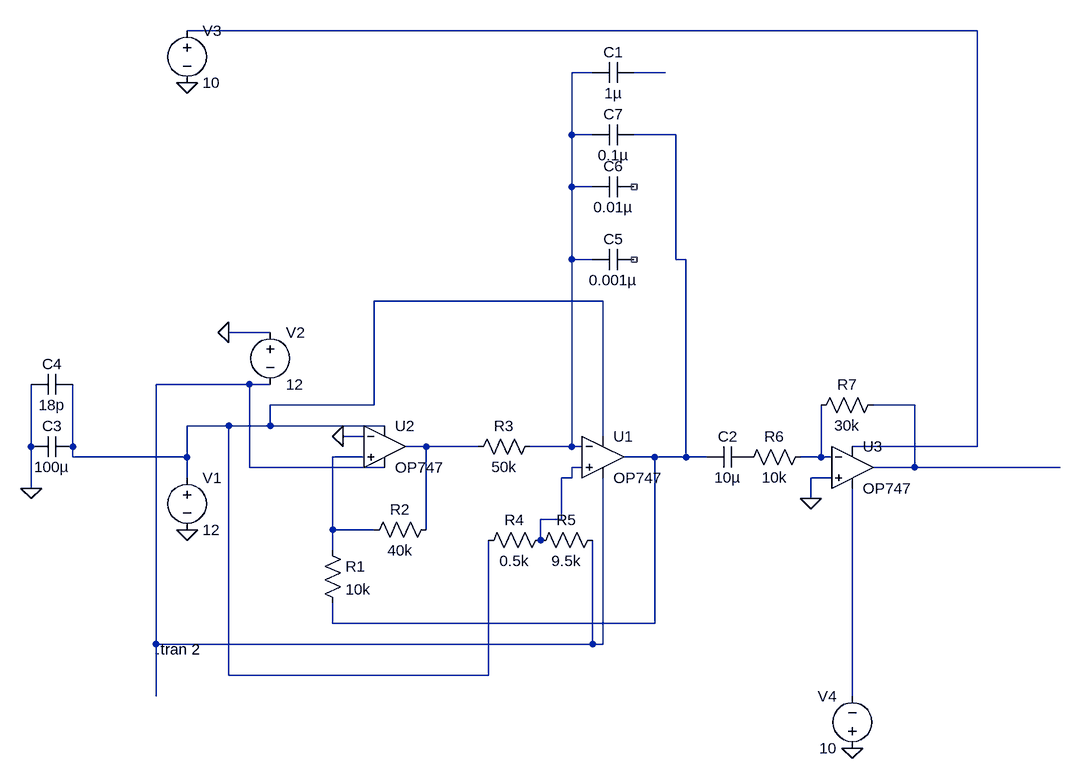
[diagram p0: schematic Saw Tooth 1.asc]
Saw Tooth 1.asc, the LTspice schematic file:
Version 4
SHEET 1 880 740
WIRE 272 -384 -944 -384
WIRE -320 -320 -352 -320
WIRE -208 -320 -256 -320
WIRE -352 -224 -352 -320
WIRE -320 -224 -352 -224
WIRE -192 -224 -256 -224
WIRE -352 -144 -352 -224
WIRE -320 -144 -352 -144
WIRE -352 -32 -352 -144
WIRE -320 -32 -352 -32
WIRE -192 -32 -192 -224
WIRE -176 -32 -192 -32
WIRE -304 32 -656 32
WIRE -816 80 -880 80
WIRE -848 160 -992 160
WIRE -816 160 -848 160
WIRE -656 192 -656 32
WIRE -656 192 -816 192
WIRE 176 192 112 192
WIRE -880 224 -944 224
WIRE -816 224 -816 192
WIRE -816 224 -880 224
WIRE -640 224 -816 224
WIRE -672 240 -704 240
WIRE -304 240 -304 32
WIRE -1184 256 -1184 160
WIRE -1120 256 -1120 160
WIRE -576 256 -608 256
WIRE -496 256 -576 256
WIRE -352 256 -352 -32
WIRE -352 256 -416 256
WIRE -336 256 -352 256
WIRE 272 256 272 -384
WIRE 272 256 80 256
WIRE -1120 272 -1120 256
WIRE -944 272 -944 224
WIRE -944 272 -1120 272
WIRE -672 272 -720 272
WIRE -224 272 -272 272
WIRE -176 272 -176 -32
WIRE -176 272 -224 272
WIRE -144 272 -176 272
WIRE 32 272 32 192
WIRE 32 272 0 272
WIRE 48 272 32 272
WIRE -848 288 -848 160
WIRE -640 288 -848 288
WIRE -336 288 -352 288
WIRE 176 288 176 192
WIRE 176 288 112 288
WIRE 400 288 176 288
WIRE -944 304 -944 272
WIRE -352 304 -352 288
WIRE -352 304 -368 304
WIRE 48 304 16 304
WIRE -1184 320 -1184 256
WIRE 16 336 16 304
WIRE -368 368 -368 304
WIRE -368 368 -400 368
WIRE -720 384 -720 272
WIRE -656 384 -720 384
WIRE -576 384 -576 256
WIRE -400 400 -400 368
WIRE -720 416 -720 384
WIRE -720 528 -720 496
WIRE -224 528 -224 272
WIRE -224 528 -720 528
WIRE -992 560 -992 160
WIRE -320 560 -320 400
WIRE -320 560 -992 560
WIRE -304 560 -304 304
WIRE -304 560 -320 560
WIRE -880 608 -880 224
WIRE -480 608 -480 400
WIRE -480 608 -880 608
WIRE -992 640 -992 560
WIRE 80 640 80 320
FLAG -704 240 0
FLAG -944 384 0
FLAG -880 80 0
FLAG -1184 320 0
FLAG 16 336 0
FLAG 80 720 0
FLAG -944 -304 0
SYMBOL OpAmps\\OP747 -640 192 R0
SYMATTR InstName U2
SYMBOL res -736 400 R0
SYMATTR InstName R1
SYMATTR Value 10k
SYMBOL res -560 368 R90
WINDOW 0 0 56 VBottom 2
WINDOW 3 32 56 VTop 2
SYMATTR InstName R2
SYMATTR Value 40k
SYMBOL res -400 240 R90
WINDOW 0 0 56 VBottom 2
WINDOW 3 32 56 VTop 2
SYMATTR InstName R3
SYMATTR Value 50k
SYMBOL OpAmps\\OP747 -304 208 R0
SYMATTR InstName U1
SYMBOL voltage -944 288 R0
WINDOW 123 0 0 Left 0
WINDOW 39 0 0 Left 0
SYMATTR InstName V1
SYMATTR Value 12
SYMBOL voltage -816 64 R0
WINDOW 123 0 0 Left 0
WINDOW 39 0 0 Left 0
SYMATTR InstName V2
SYMATTR Value 12
SYMBOL res -384 384 R90
WINDOW 0 0 56 VBottom 2
WINDOW 3 32 56 VTop 2
SYMATTR InstName R4
SYMATTR Value 0.5k
SYMBOL res -304 384 R90
WINDOW 0 0 56 VBottom 2
WINDOW 3 32 56 VTop 2
SYMATTR InstName R5
SYMATTR Value 9.5k
SYMBOL cap -80 256 R90
WINDOW 0 0 32 VBottom 2
WINDOW 3 32 32 VTop 2
SYMATTR InstName C2
SYMATTR Value 10µ
SYMBOL cap -1120 240 R90
WINDOW 0 0 32 VBottom 2
WINDOW 3 32 32 VTop 2
SYMATTR InstName C3
SYMATTR Value 100µ
SYMBOL cap -1120 144 R90
WINDOW 0 0 32 VBottom 2
WINDOW 3 32 32 VTop 2
SYMATTR InstName C4
SYMATTR Value 18p
SYMBOL cap -256 -48 R90
WINDOW 0 0 32 VBottom 2
WINDOW 3 32 32 VTop 2
SYMATTR InstName C5
SYMATTR Value 0.001µ
SYMBOL cap -256 -160 R90
WINDOW 0 0 32 VBottom 2
WINDOW 3 32 32 VTop 2
SYMATTR InstName C6
SYMATTR Value 0.01µ
SYMBOL cap -256 -240 R90
WINDOW 0 0 32 VBottom 2
WINDOW 3 32 32 VTop 2
SYMATTR InstName C7
SYMATTR Value 0.1µ
SYMBOL cap -256 -336 R90
WINDOW 0 0 32 VBottom 2
WINDOW 3 32 32 VTop 2
SYMATTR InstName C1
SYMATTR Value 1µ
SYMBOL OpAmps\\OP747 80 224 R0
SYMATTR InstName U3
SYMBOL res 16 256 R90
WINDOW 0 0 56 VBottom 2
WINDOW 3 32 56 VTop 2
SYMATTR InstName R6
SYMATTR Value 10k
SYMBOL res 128 176 R90
WINDOW 0 0 56 VBottom 2
WINDOW 3 32 56 VTop 2
SYMATTR InstName R7
SYMATTR Value 30k
SYMBOL voltage -944 -400 R0
WINDOW 123 0 0 Left 0
WINDOW 39 0 0 Left 0
SYMATTR InstName V3
SYMATTR Value 10
SYMBOL voltage 80 736 R180
WINDOW 0 24 96 Left 2
WINDOW 3 24 16 Left 2
WINDOW 123 0 0 Left 0
WINDOW 39 0 0 Left 0
SYMATTR InstName V4
SYMATTR Value 10
TEXT -992 568 Left 2 !.tran 2

The netlist it stands for:
* Saw Tooth 1.asc
XU2 N009 0 N005 N006 N008 OP747  ; pins In+ In- V+ V- OUT
R1 N009 N004 10k
R2 N008 N009 40k
R3 N002 N008 50k
XU1 N011 N002 N005 N006 N004 OP747  ; pins In+ In- V+ V- OUT
V1 N005 0 12
V2 0 N006 12
R4 N011 N005 0.5k
R5 N006 N011 9.5k
C2 P001 N004 10µ
C3 N005 0 100µ
C4 N005 0 18p
C5 NC_01 N002 0.001µ
C6 NC_02 N002 0.01µ
C7 N004 N002 0.1µ
C1 N003 N002 1µ
XU3 0 N010 N001 N012 N007 OP747  ; pins In+ In- V+ V- OUT
R6 N010 P001 10k
R7 N007 N010 30k
V3 N001 0 10
V4 0 N012 10
.tran 2
.backanno
.end